# Altium project ControllorBord.PrjPcb
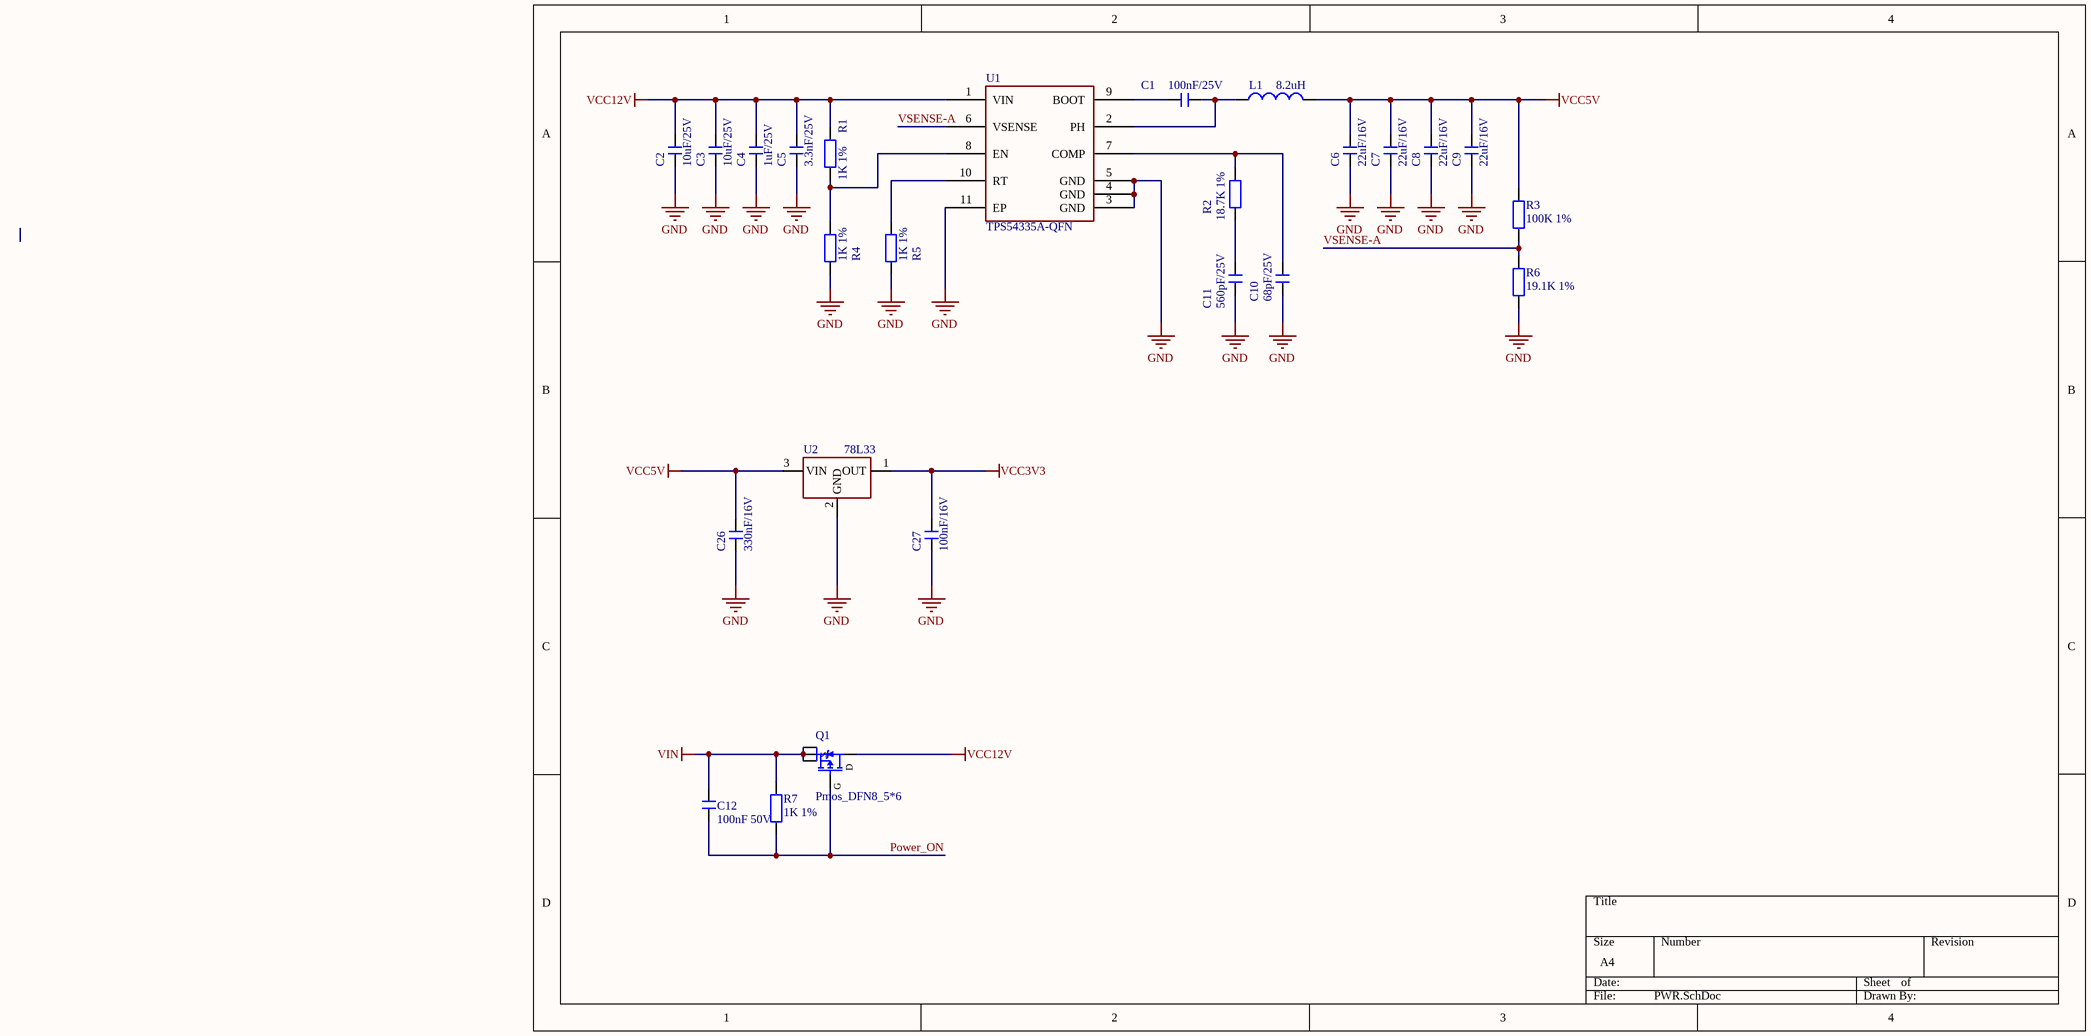
[diagram p0: PWR.SchDoc]
3 sheets, 58 parts. Net scope: global (net labels, ports and power ports of the same name join across sheets).
Board file: PCB.PcbDoc
Sheets:
  PWR.SchDoc
  MCU.SchDoc
  Connector.SchDoc

## Sheet PWR.SchDoc
size A4; SheetNumber: 1; SheetTotal: 3

### Parts
C1  100nF/25V  [c0603_l]
C2  10uF/25V  [c0603_l]
C3  10uF/25V  [c0603_l]
C4  1uF/25V  [c0603_l]
C5  3.3nF/25V  [c0603_l]
C6  22uF/16V  [c0603_l]
C7  22uF/16V  [c0603_l]
C8  22uF/16V  [c0603_l]
C9  22uF/16V  [c0603_l]
C10  68pF/25V  [c0603_l]
C11  560pF/25V  [c0603_l]
C12  100nF 50V  [c0603_l]
C26  330nF/16V  [c0603_l]
C27  100nF/16V  [c0603_l]
L1  8.2uH  [NR4020]
Q1  Pmos_DFN8_5*6  [DFN8_5*6]
R1  1K 1%  [r0603_l]
R2  18.7K 1%  [r0603_l]
R3  100K 1%  [r0603_l]
R4  1K 1%  [r0603_l]
R5  1K 1%  [r0603_l]
R6  19.1K 1%  [r0603_l]
R7  1K 1%  [r0603_l]
U1  TPS54335A-QFN  [VSON-10_L3.0-W3.0-P0.50-TL-EP]
U2  78L33  [SOT89_L]

### Nets
GND: C2.1 C3.1 C4.1 C5.1 C6.1 C7.1 C8.1 C9.1 C10.1 C11.1 C26.1 C27.1 R4.2 R5.2 R6.2 U1.3(GND) U1.4(GND) U1.5(GND) U1.11(EP) U2.2(GND)
VCC3V3: C27.2 U2.1(OUT)
VCC5V: C6.2 C7.2 C8.2 C9.2 C26.2 L1.2 R3.1 U2.3(VIN)
VCC12V: C2.2 C3.2 C4.2 C5.2 Q1.5(D) R1.1 U1.1(VIN)
VIN: C12.1 Q1.1(S) Q1.2(S) Q1.3(S) R7.1
Power_ON: C12.2 Q1.4(G) R7.2
VSENSE-A: R3.2 R6.1 U1.6(VSENSE)
NetC1_1: C1.1 L1.1 U1.2(PH)
NetC1_2: C1.2 U1.9(BOOT)
NetC10_2: C10.2 R2.1 U1.7(COMP)
NetC11_2: C11.2 R2.2
NetR1_2: R1.2 R4.1 U1.8(EN)
NetR5_1: R5.1 U1.10(RT)

### Library data of the parts
C1-C12 C26 C27 = C: 无极性贴片电容; 版权归属: 源创客; 材质: X7R; BOM名称: 无极性贴片电容; 学习资源: www.ooocke.com
L1 = L: 小功率贴片电感; 版权归属: 源创客; BOM名称: 小功率贴片电感; 学习资源: www.ooocke.com
Q1 = Pmos_DFN8_5*6: BOM名称: 场效应管; 版权归属: 源创客; 描述: P沟道 30V/4.2A; 学习资源: www.ooocke.com
R1-R7 = R: 贴片电阻; 版权归属: 源创客; BOM名称: 贴片电阻; 学习资源: www.ooocke.com
U1 = TPS54335A-QFN: BUCK

## Sheet MCU.SchDoc
size A3; SheetNumber: 2; SheetTotal: 3
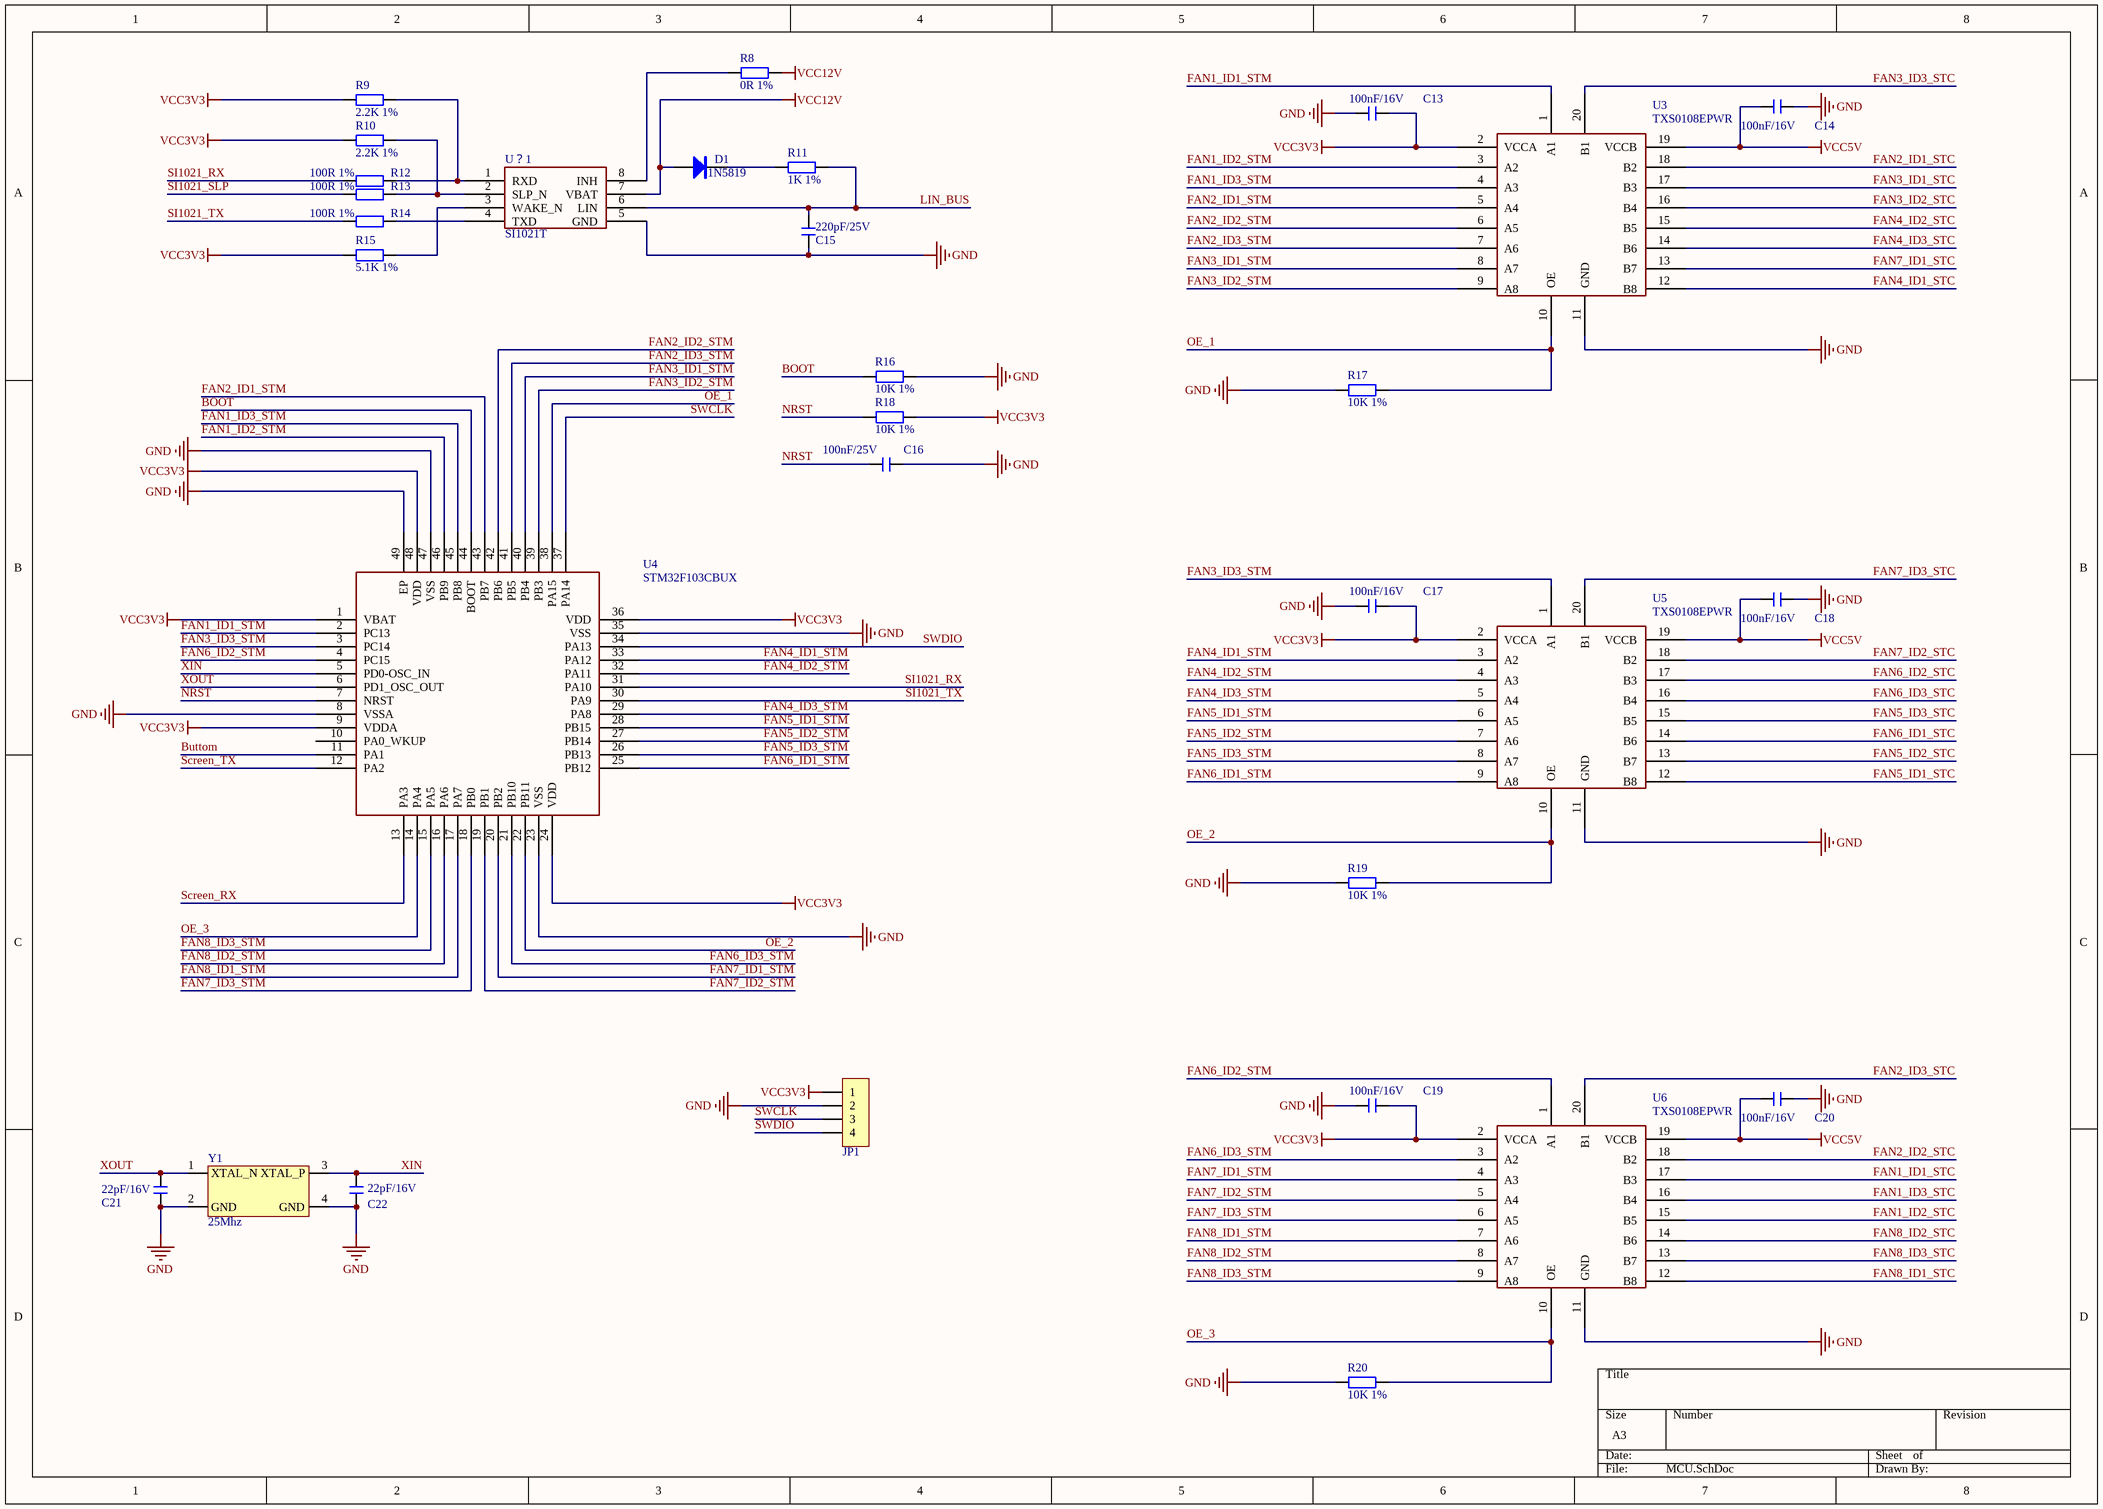
[diagram p1: MCU.SchDoc]

### Parts
C13  100nF/16V  [c0603_l]
C14  100nF/16V  [c0603_l]
C15  220pF/25V  [c0603_l]
C16  100nF/25V  [c0603_l]
C17  100nF/16V  [c0603_l]
C18  100nF/16V  [c0603_l]
C19  100nF/16V  [c0603_l]
C20  100nF/16V  [c0603_l]
C21  22pF/16V  [c0603_l]
C22  22pF/16V  [c0603_l]
D1  1N5819  [SOD-323]
JP1  HDR-1X4  [HDR2.54-WI-4P]  (value not drawn)
R8  0R 1%  [r0603_l]
R9  2.2K 1%  [r0603_l]
R10  2.2K 1%  [r0603_l]
R11  1K 1%  [r0603_l]
R12  100R 1%  [r0603_l]
R13  100R 1%  [r0603_l]
R14  100R 1%  [r0603_l]
R15  5.1K 1%  [r0603_l]
R16  10K 1%  [r0603_l]
R17  10K 1%  [r0603_l]
R18  10K 1%  [r0603_l]
R19  10K 1%  [r0603_l]
R20  10K 1%  [r0603_l]
U3  TXS0108EPWR  [TXS0108ERGYR]
U4  STM32F103CBUX  [QFN48 7X7_M]
U5  TXS0108EPWR  [TXS0108ERGYR]
U6  TXS0108EPWR  [TXS0108ERGYR]
U？1  SI1021T  [SOP8]
Y1  25Mhz  [OSC 3225-4P]

### Nets
GND: C13.2 C14.1 C15.1 C16.1 C17.2 C18.1 C19.2 C20.1 C21.2 C22.2 JP1.2 R16.2 R17.1 R19.1 R20.1 U3.11(GND) U4.8(VSSA) U4.23(VSS) U4.35(VSS) U4.47(VSS) U4.49(EP) U5.11(GND) U6.11(GND) U？1.5(GND) Y1.2(GND) Y1.4(GND)
VCC3V3: C13.1 C17.1 C19.1 JP1.1 R9.2 R10.2 R15.2 R18.2 U3.2(VCCA) U4.1(VBAT) U4.9(VDDA) U4.24(VDD) U4.36(VDD) U4.48(VDD) U5.2(VCCA) U6.2(VCCA)
VCC5V: C14.2 C18.2 C20.2 U3.19(VCCB) U5.19(VCCB) U6.19(VCCB)
VCC12V: D1.1(A) R8.1 U？1.7(VBAT)
BOOT: R16.1 U4.44(BOOT)
Buttom: U4.11(PA1)
FAN1_ID1_STC: U6.17(B3)
FAN1_ID1_STM: U3.1(A1) U4.2(PC13)
FAN1_ID2_STC: U6.15(B5)
FAN1_ID2_STM: U3.3(A2) U4.46(PB9)
FAN1_ID3_STC: U6.16(B4)
FAN1_ID3_STM: U3.4(A3) U4.45(PB8)
FAN2_ID1_STC: U3.18(B2)
FAN2_ID1_STM: U3.5(A4) U4.43(PB7)
FAN2_ID2_STC: U6.18(B2)
FAN2_ID2_STM: U3.6(A5) U4.42(PB6)
FAN2_ID3_STC: U6.20(B1)
FAN2_ID3_STM: U3.7(A6) U4.41(PB5)
FAN3_ID1_STC: U3.17(B3)
FAN3_ID1_STM: U3.8(A7) U4.40(PB4)
FAN3_ID2_STC: U3.16(B4)
FAN3_ID2_STM: U3.9(A8) U4.39(PB3)
FAN3_ID3_STC: U3.20(B1)
FAN3_ID3_STM: U4.3(PC14) U5.1(A1)
FAN4_ID1_STC: U3.12(B8)
FAN4_ID1_STM: U4.33(PA12) U5.3(A2)
FAN4_ID2_STC: U3.15(B5)
FAN4_ID2_STM: U4.32(PA11) U5.4(A3)
FAN4_ID3_STC: U3.14(B6)
FAN4_ID3_STM: U4.29(PA8) U5.5(A4)
FAN5_ID1_STC: U5.12(B8)
FAN5_ID1_STM: U4.28(PB15) U5.6(A5)
FAN5_ID2_STC: U5.13(B7)
FAN5_ID2_STM: U4.27(PB14) U5.7(A6)
FAN5_ID3_STC: U5.15(B5)
FAN5_ID3_STM: U4.26(PB13) U5.8(A7)
FAN6_ID1_STC: U5.14(B6)
FAN6_ID1_STM: U4.25(PB12) U5.9(A8)
FAN6_ID2_STC: U5.17(B3)
FAN6_ID2_STM: U4.4(PC15) U6.1(A1)
FAN6_ID3_STC: U5.16(B4)
FAN6_ID3_STM: U4.21(PB10) U6.3(A2)
FAN7_ID1_STC: U3.13(B7)
FAN7_ID1_STM: U4.20(PB2) U6.4(A3)
FAN7_ID2_STC: U5.18(B2)
FAN7_ID2_STM: U4.19(PB1) U6.5(A4)
FAN7_ID3_STC: U5.20(B1)
FAN7_ID3_STM: U4.18(PB0) U6.6(A5)
FAN8_ID1_STC: U6.12(B8)
FAN8_ID1_STM: U4.17(PA7) U6.7(A6)
FAN8_ID2_STC: U6.14(B6)
FAN8_ID2_STM: U4.16(PA6) U6.8(A7)
FAN8_ID3_STC: U6.13(B7)
FAN8_ID3_STM: U4.15(PA5) U6.9(A8)
LIN_BUS: C15.2 R11.1 U？1.6(LIN)
NRST: C16.2 R18.1 U4.7(NRST)
OE_1: R17.2 U3.10(OE) U4.38(PA15)
OE_2: R19.2 U4.22(PB11) U5.10(OE)
OE_3: R20.2 U4.14(PA4) U6.10(OE)
Screen_RX: U4.13(PA3)
Screen_TX: U4.12(PA2)
SI1021_RX: R12.1 U4.31(PA10)
SI1021_SLP: R13.1
SI1021_TX: R14.1 U4.30(PA9)
SWCLK: JP1.3 U4.37(PA14)
SWDIO: JP1.4 U4.34(PA13)
XIN: C22.1 U4.5(PD0-OSC_IN) Y1.3(XTAL_P)
XOUT: C21.1 U4.6(PD1_OSC_OUT) Y1.1(XTAL_N)
NetD1_2: D1.2(K) R11.2
NetR8_2: R8.2 U？1.8(INH)
NetR9_1: R9.1 R12.2 U？1.1(RXD)
NetR10_1: R10.1 R13.2 U？1.2(SLP_N)
NetR14_2: R14.2 U？1.4(TXD)
NetR15_1: R15.1 U？1.3(WAKE_N)

Not connected (* = marked no-connect by the designer): U4 10(PA0_WKUP)

### Library data of the parts
C13-C22 = C: 无极性贴片电容; 版权归属: 源创客; 材质: X7R; BOM名称: 无极性贴片电容; 学习资源: www.ooocke.com
D1 = 1N5819: 肖特基二极管; 版权归属: 源创客; 属性: 40V/2A; BOM名称: 肖特基二极管; 学习资源: www.ooocke.com
JP1 = Header 4: 4P接插件; 版权归属: 源创客; BOM名称: 4P接插件; 学习资源: www.ooocke.com
R8-R20 = R: 贴片电阻; 版权归属: 源创客; BOM名称: 贴片电阻; 学习资源: www.ooocke.com
U3 U5 U6 = TXS0108EPWR: 适用于开漏和推挽应用的八位双向电压电平转换器
U？1 = SI1021T: SI1021T LIN收发器
Y1 = Crystal

## Sheet Connector.SchDoc
size A4; SheetNumber: 3; SheetTotal: 3
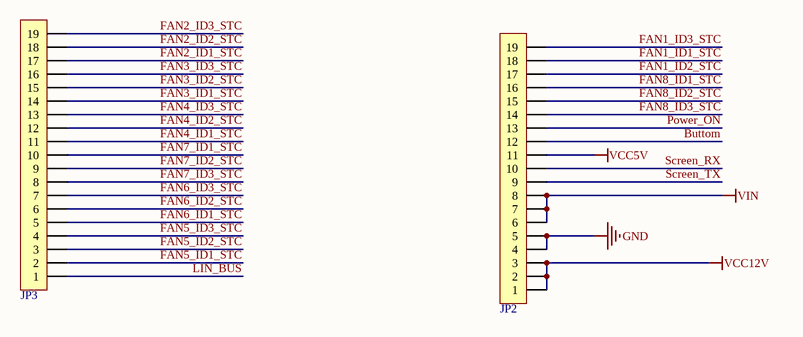
[diagram p2: Connector.SchDoc]

### Parts
JP2  HDR-1X19  [贴片排母2.54mm_交错_19P]  (value not drawn)
JP3  HDR-1X19  [贴片排母2.54mm_交错_19P]  (value not drawn)

### Nets
GND: JP2.4 JP2.5
VCC5V: JP2.11
VCC12V: JP2.1 JP2.2 JP2.3
VIN: JP2.6 JP2.7 JP2.8
Buttom: JP2.12
FAN1_ID1_STC: JP2.18
FAN1_ID2_STC: JP2.17
FAN1_ID3_STC: JP2.19
FAN2_ID1_STC: JP3.17
FAN2_ID2_STC: JP3.18
FAN2_ID3_STC: JP3.19
FAN3_ID1_STC: JP3.14
FAN3_ID2_STC: JP3.15
FAN3_ID3_STC: JP3.16
FAN4_ID1_STC: JP3.11
FAN4_ID2_STC: JP3.12
FAN4_ID3_STC: JP3.13
FAN5_ID1_STC: JP3.2
FAN5_ID2_STC: JP3.3
FAN5_ID3_STC: JP3.4
FAN6_ID1_STC: JP3.5
FAN6_ID2_STC: JP3.6
FAN6_ID3_STC: JP3.7
FAN7_ID1_STC: JP3.10
FAN7_ID2_STC: JP3.9
FAN7_ID3_STC: JP3.8
FAN8_ID1_STC: JP2.16
FAN8_ID2_STC: JP2.15
FAN8_ID3_STC: JP2.14
LIN_BUS: JP3.1
Power_ON: JP2.13
Screen_RX: JP2.10
Screen_TX: JP2.9

### Library data of the parts
JP2 JP3 = Header 19: 19P接插件; 版权归属: 源创客; BOM名称: 19P接插件; 学习资源: www.ooocke.com

## Nets that join several sheets
GND: PWR (20 pins), MCU (26 pins), Connector (JP2.4 JP2.5)
VCC3V3: PWR (C27.2 U2.1), MCU (16 pins)
VCC5V: PWR (8 pins), MCU (6 pins), Connector (JP2.11)
VCC12V: PWR (7 pins), MCU (D1.1 R8.1 U？1.7), Connector (JP2.1 JP2.2 JP2.3)
VIN: PWR (5 pins), Connector (JP2.6 JP2.7 JP2.8)
Buttom: MCU (U4.11), Connector (JP2.12)
FAN1_ID1_STC: MCU (U6.17), Connector (JP2.18)
FAN1_ID2_STC: MCU (U6.15), Connector (JP2.17)
FAN1_ID3_STC: MCU (U6.16), Connector (JP2.19)
FAN2_ID1_STC: MCU (U3.18), Connector (JP3.17)
FAN2_ID2_STC: MCU (U6.18), Connector (JP3.18)
FAN2_ID3_STC: MCU (U6.20), Connector (JP3.19)
FAN3_ID1_STC: MCU (U3.17), Connector (JP3.14)
FAN3_ID2_STC: MCU (U3.16), Connector (JP3.15)
FAN3_ID3_STC: MCU (U3.20), Connector (JP3.16)
FAN4_ID1_STC: MCU (U3.12), Connector (JP3.11)
FAN4_ID2_STC: MCU (U3.15), Connector (JP3.12)
FAN4_ID3_STC: MCU (U3.14), Connector (JP3.13)
FAN5_ID1_STC: MCU (U5.12), Connector (JP3.2)
FAN5_ID2_STC: MCU (U5.13), Connector (JP3.3)
FAN5_ID3_STC: MCU (U5.15), Connector (JP3.4)
FAN6_ID1_STC: MCU (U5.14), Connector (JP3.5)
FAN6_ID2_STC: MCU (U5.17), Connector (JP3.6)
FAN6_ID3_STC: MCU (U5.16), Connector (JP3.7)
FAN7_ID1_STC: MCU (U3.13), Connector (JP3.10)
FAN7_ID2_STC: MCU (U5.18), Connector (JP3.9)
FAN7_ID3_STC: MCU (U5.20), Connector (JP3.8)
FAN8_ID1_STC: MCU (U6.12), Connector (JP2.16)
FAN8_ID2_STC: MCU (U6.14), Connector (JP2.15)
FAN8_ID3_STC: MCU (U6.13), Connector (JP2.14)
LIN_BUS: MCU (C15.2 R11.1 U？1.6), Connector (JP3.1)
Power_ON: PWR (C12.2 Q1.4 R7.2), Connector (JP2.13)
Screen_RX: MCU (U4.13), Connector (JP2.10)
Screen_TX: MCU (U4.12), Connector (JP2.9)